# Altium schematic sheet MB-01.SchDoc
size A
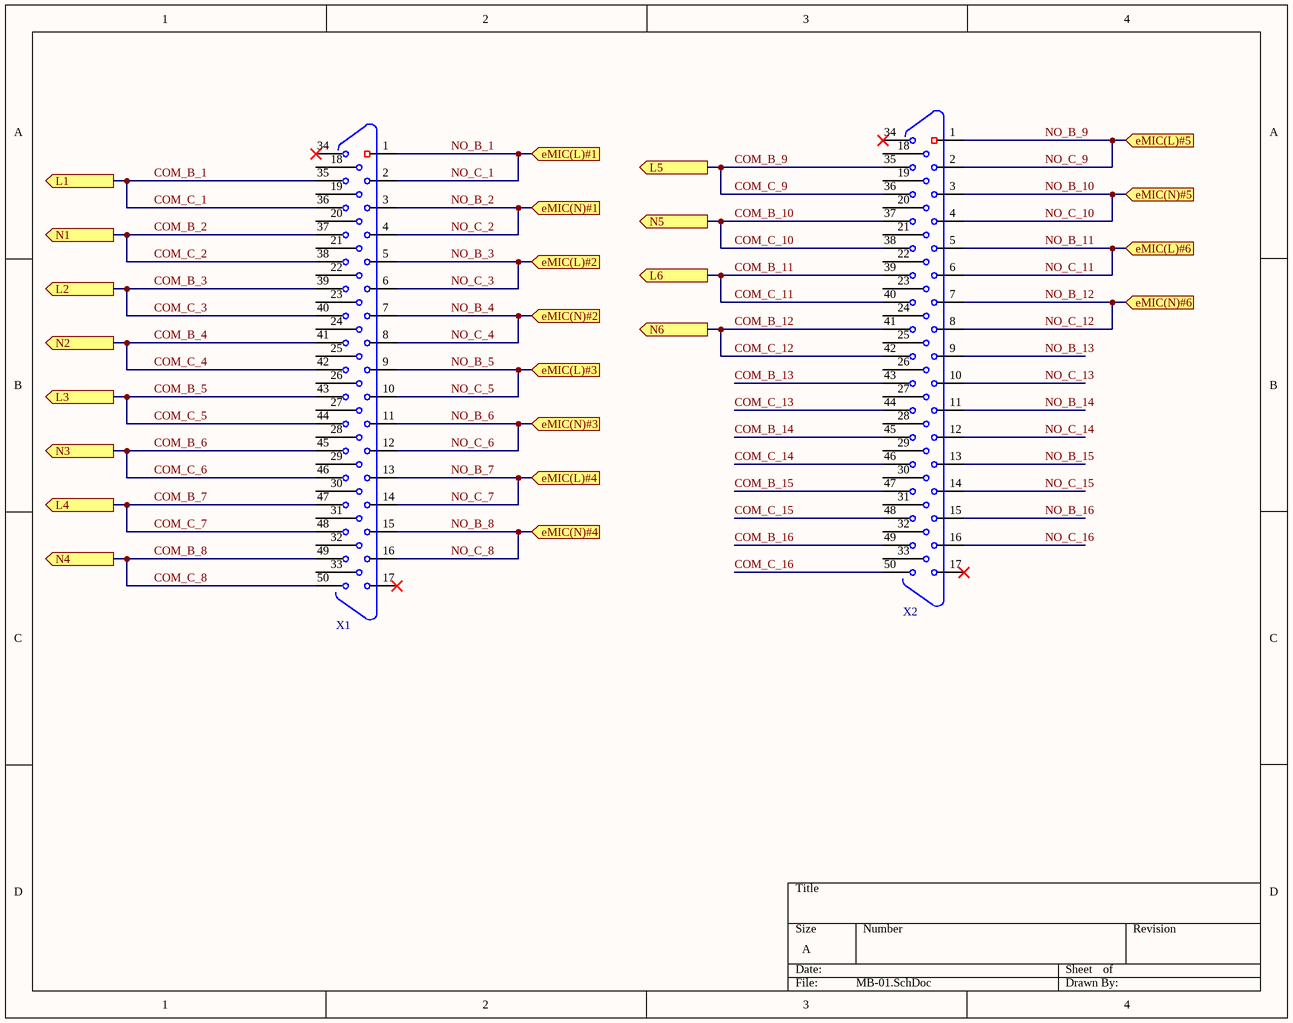
[diagram p0: MB-01.SchDoc]

## Parts
X1  DB50  [DB50_RA]  (value not drawn)
X2  DB50  [DB50_RA]  (value not drawn)

## Ports
eMIC(L)#1 (in), eMIC(L)#2 (in), eMIC(L)#3 (in), eMIC(L)#4 (in), eMIC(L)#5 (in), eMIC(L)#6 (in), eMIC(N)#1 (in), eMIC(N)#2 (in), eMIC(N)#3 (in), eMIC(N)#4 (in), eMIC(N)#5 (in), eMIC(N)#6 (in), L1 (out), L2 (out), L3 (out), L4 (out), L5 (out), L6 (out), N1 (out), N2 (out), N3 (out), N4 (out), N5 (out), N6 (out)

## Nets
COM_B_1: X1.35 X1.36 ; port L1  [also labelled COM_C_1]
COM_B_2: X1.37 X1.38 ; port N1  [also labelled COM_C_2]
COM_B_3: X1.39 X1.40 ; port L2  [also labelled COM_C_3]
COM_B_4: X1.41 X1.42 ; port N2  [also labelled COM_C_4]
COM_B_5: X1.43 X1.44 ; port L3  [also labelled COM_C_5]
COM_B_6: X1.45 X1.46 ; port N3  [also labelled COM_C_6]
COM_B_7: X1.47 X1.48 ; port L4  [also labelled COM_C_7]
COM_B_8: X1.49 X1.50 ; port N4  [also labelled COM_C_8]
COM_B_9: X2.35 X2.36 ; port L5  [also labelled COM_C_9]
COM_B_10: X2.37 X2.38 ; port N5  [also labelled COM_C_10]
COM_B_11: X2.39 X2.40 ; port L6  [also labelled COM_C_11]
COM_B_12: X2.41 X2.42 ; port N6  [also labelled COM_C_12]
COM_B_13: X2.43
COM_B_14: X2.45
COM_B_15: X2.47
COM_B_16: X2.49
COM_C_13: X2.44
COM_C_14: X2.46
COM_C_15: X2.48
COM_C_16: X2.50
NO_B_1: X1.1 X1.2 ; port eMIC(L)#1  [also labelled NO_C_1]
NO_B_2: X1.3 X1.4 ; port eMIC(N)#1  [also labelled NO_C_2]
NO_B_3: X1.5 X1.6 ; port eMIC(L)#2  [also labelled NO_C_3]
NO_B_4: X1.7 X1.8 ; port eMIC(N)#2  [also labelled NO_C_4]
NO_B_5: X1.9 X1.10 ; port eMIC(L)#3  [also labelled NO_C_5]
NO_B_6: X1.11 X1.12 ; port eMIC(N)#3  [also labelled NO_C_6]
NO_B_7: X1.13 X1.14 ; port eMIC(L)#4  [also labelled NO_C_7]
NO_B_8: X1.15 X1.16 ; port eMIC(N)#4  [also labelled NO_C_8]
NO_B_9: X2.1 X2.2 ; port eMIC(L)#5  [also labelled NO_C_9]
NO_B_10: X2.3 X2.4 ; port eMIC(N)#5  [also labelled NO_C_10]
NO_B_11: X2.5 X2.6 ; port eMIC(L)#6  [also labelled NO_C_11]
NO_B_12: X2.7 X2.8 ; port eMIC(N)#6  [also labelled NO_C_12]
NO_B_13: X2.9
NO_B_14: X2.11
NO_B_15: X2.13
NO_B_16: X2.15
NO_C_13: X2.10
NO_C_14: X2.12
NO_C_15: X2.14
NO_C_16: X2.16

Not connected (* = marked no-connect by the designer): X1 17* 18 19 20 21 22 23 24(7) 25(3) 26 27 28 29 30 31 32 33 34*; X2 17* 18 19 20 21 22 23 24(7) 25(3) 26 27 28 29 30 31 32 33 34*